# EAGLE schematic MRCS-ODX4 (EAGLE 6.5.0)
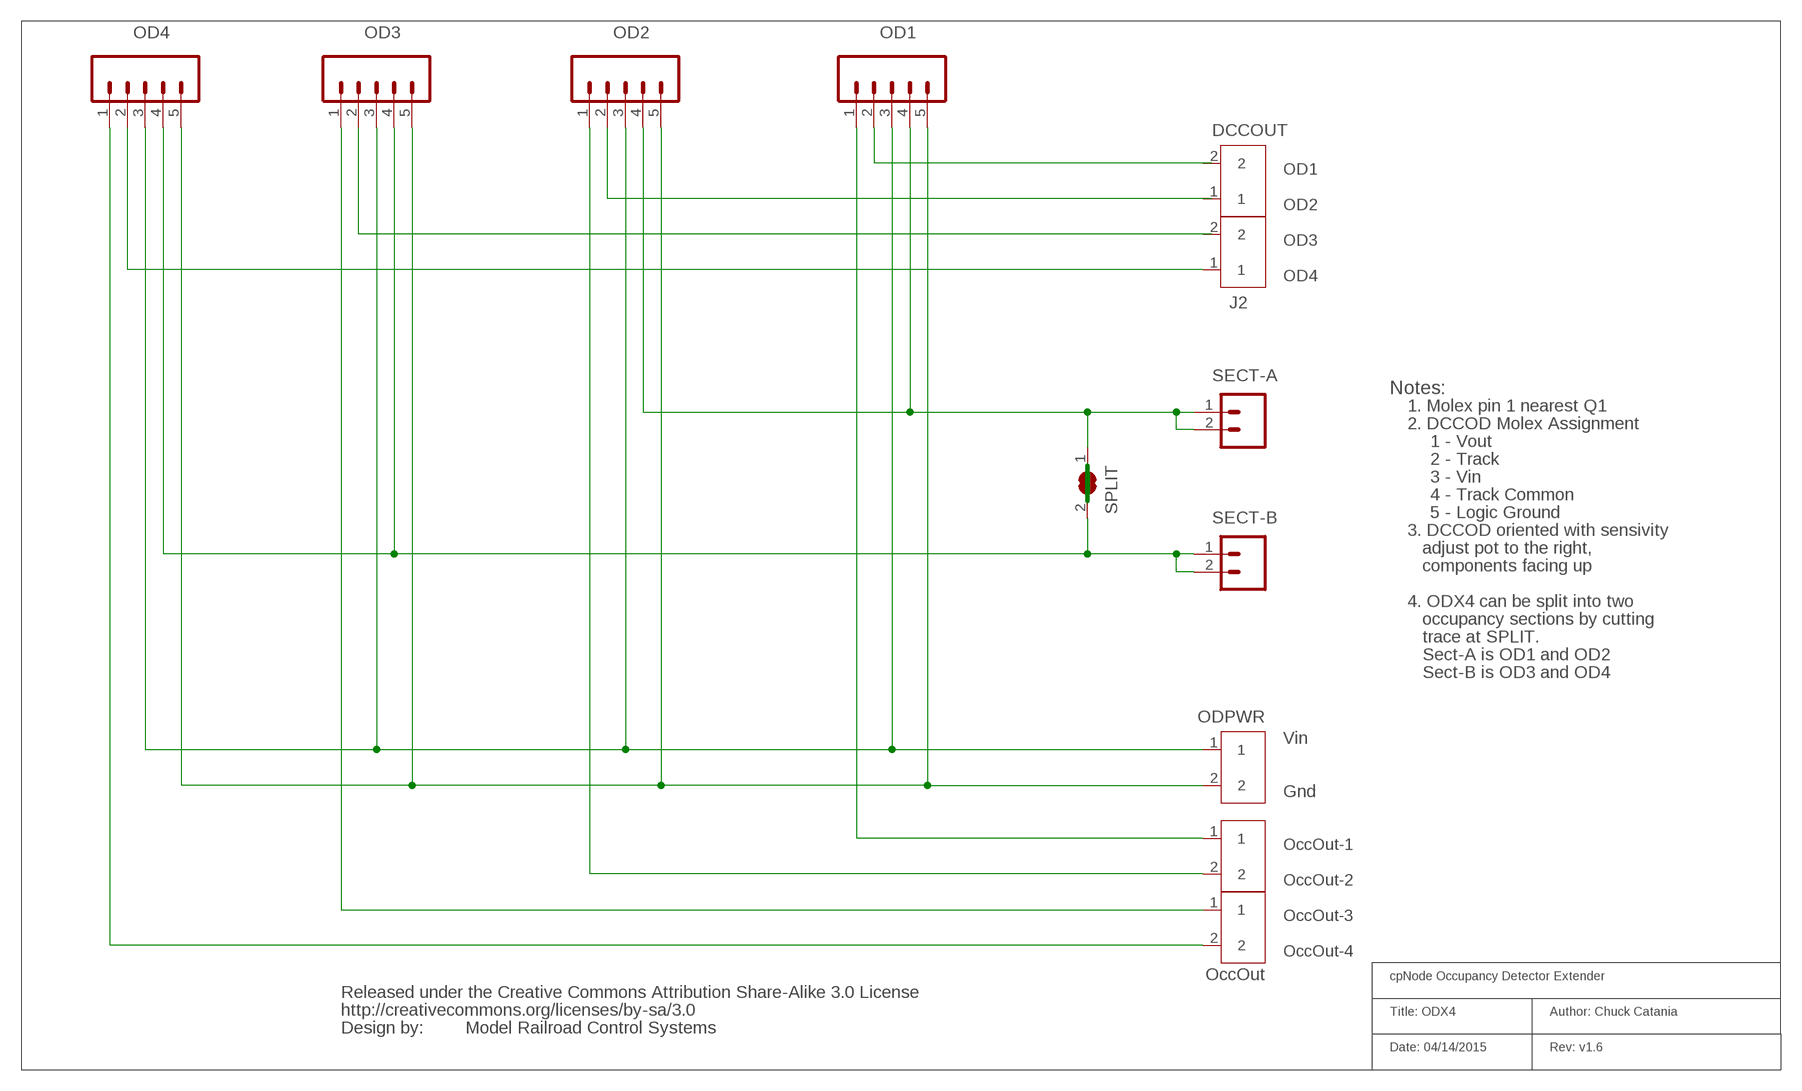
[diagram p0: schematic, sheet 1]

## Parts
DCCOUT  SCREW-TERMINAL-2P  [2P-3.36]
J2  SCREW-TERMINAL-2P  [2P-3.36]
OD1  M05PTH_LONGPADS  [1X05_LONGPADS]
OD2  M05PTH_LONGPADS  [1X05_LONGPADS]
OD3  M05PTH_LONGPADS  [1X05_LONGPADS]
OD4  M05PTH_LONGPADS  [1X05_LONGPADS]
ODPWR  SCREW-TERMINAL-2P  [2P-3.36]
ODXPWR1  SCREW-TERMINAL-2P  [2P-3.36]
ODXPWR2  SCREW-TERMINAL-2P  [2P-3.36]
SECT-A  M025MM  [SCREWTERMINAL-5MM-2]
SECT-B  M025MM  [SCREWTERMINAL-5MM-2]
SPLIT  SJW  [SJW]
U$1  CREATIVE_COMMONS  [CREATIVE_COMMONS]

## Nets
N$1: J2.1 OD4.2
N$2: OD1.1 ODXPWR1.1
N$3: DCCOUT.2 OD1.2
N$4: DCCOUT.1 OD2.2
N$5: OD3.1 ODXPWR2.1
N$6: OD1.5 OD2.5 OD3.5 OD4.5 ODPWR.2
N$9: OD2.1 ODXPWR1.2
N$10: ODXPWR2.2
N$11: OD3.4 OD4.4 SECT-B.1 SECT-B.2 SPLIT.2
N$12: OD1.4 OD2.4 SECT-A.1 SECT-A.2 SPLIT.1
N$13: OD4.1
N$14: J2.2 OD3.2
N$15: OD1.3 OD2.3 OD3.3 OD4.3 ODPWR.1

## Notes on the sheet
- OD1
- OD2
- OD3
- OD4
- Notes:
- 1. Molex pin 1 nearest Q1
- 2. DCCOD Molex Assignment
- 1 - Vout
- 2 - Track
- 3 - Vin
- 4 - Track Common
- 5 - Logic Ground
- 3. DCCOD oriented with sensivity
- adjust pot to the right,
- components facing up
- 4. ODX4 can be split into two
- occupancy sections by cutting
- trace at SPLIT.
- Sect-A is OD1 and OD2
- Sect-B is OD3 and OD4
- Vin
- Gnd
- OccOut-1
- OccOut-2
- OccOut-3
- OccOut-4
- OccOut | cpNode Occupancy Detector Extender
- Title: ODX4 | Author: Chuck Catania
- Model Railroad Control Systems
- Date: 04/14/2015 | Rev: v1.6

## Library data of the parts
DCCOUT J2 ODPWR ODXPWR1 ODXPWR2 = Connector:SCREW-TERMINAL-2P
OD1-OD4 = SparkFun:M05: Header 5 Standard 5-pin 0.1" header. Use with straight break away headers (SKU : PRT-00116), right angle break away headers (PRT-00553), swiss pins (PRT-00743), machine pins (PRT-00117), and female headers (PRT-00115). Molex polarized connector foot print use with SKU : PRT-08230 with associated crimp pins and housings.
SECT-A SECT-B = SparkFun-Connectors:M02: Standard 2-pin 0.1" header. Use with - straight break away headers ( PRT-00116) - right angle break away headers (PRT-00553) - swiss pins (PRT-00743) - machine pins (PRT-00117) - female headers (PRT-00115) Molex polarized connector foot print use with: PRT-08233 with associated crimp pins and housings. 2.54_SCREWTERM for use with PRT-10571. 3.5mm Screw Terminal footprints for PRT-08084 5mm Screw Terminal footprints for use with PRT-08433
SPLIT = jumper:SJ: SMD solder JUMPER
U$1 = SparkFun:CREATIVE_COMMONS